# Altium project PCB_Project.PrjPcb
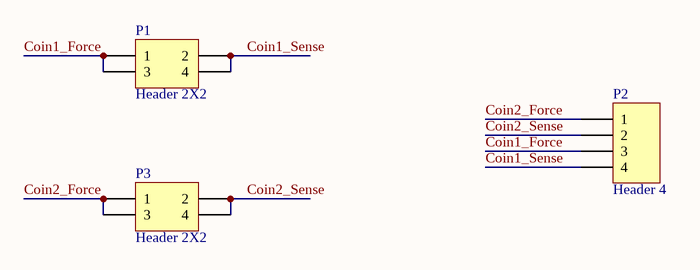
[diagram p0: IV_PogopinConnector.SchDoc]
_ProjectName: IV Connector
1 sheet, 3 parts. Net scope: global (net labels, ports and power ports of the same name join across sheets).
Board file: 6C-2L-1550um.PcbDoc

## Sheet IV_PogopinConnector.SchDoc
size A3; SheetNumber: 1; SheetTotal: 1

### Parts
P1  Header 2X2  [HDR2X2]
P2  Header 4  [HDR1X4]
P3  Header 2X2  [HDR2X2]

### Nets
Coin1_Force: P1.1 P1.3 P2.3
Coin1_Sense: P1.2 P1.4 P2.4
Coin2_Force: P2.1 P3.1 P3.3
Coin2_Sense: P2.2 P3.2 P3.4

### Library data of the parts
P1 P3 = Header 2X2: Header, 2-Pin, Dual row; LatestRevisionDate: 17-Jul-2002; LatestRevisionNote: Re-released for DXP Platform.; Publisher: Altium Limited
P2 = Header 4: Header, 4-Pin; LatestRevisionDate: 17-Jul-2002; LatestRevisionNote: Re-released for DXP Platform.; Publisher: Altium Limited